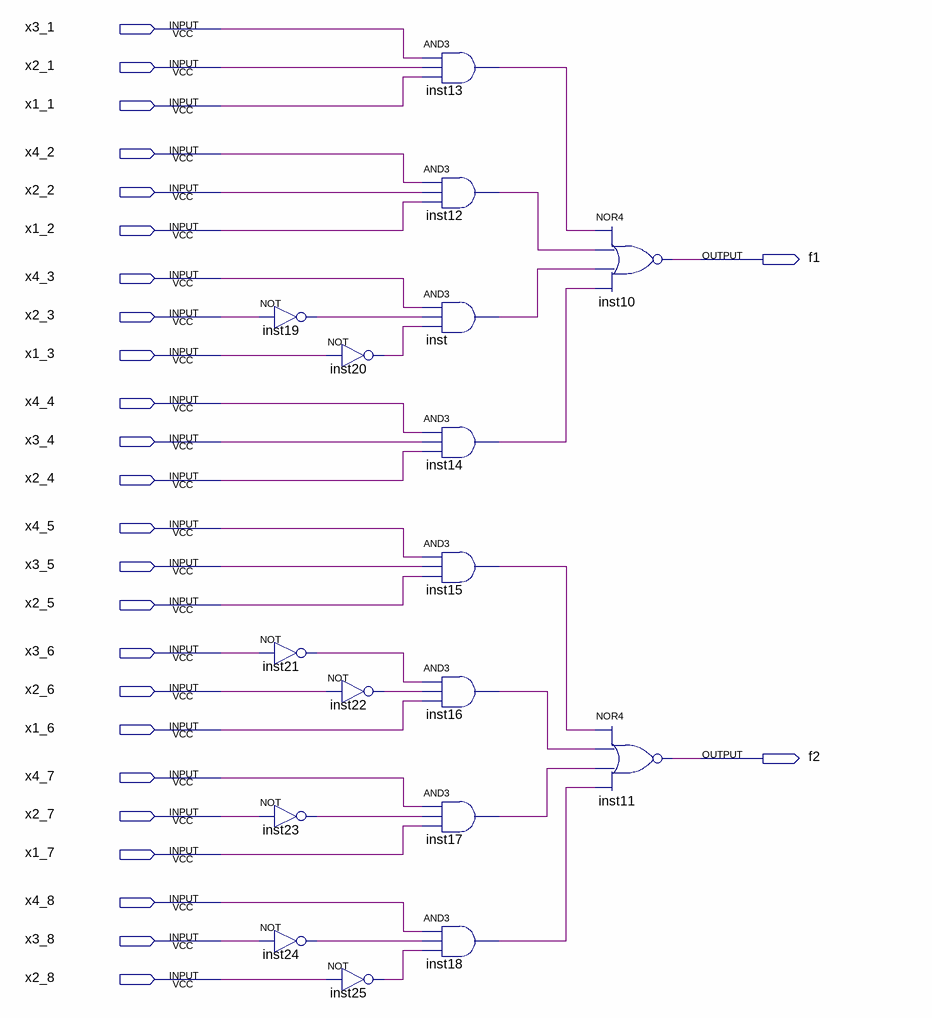
[diagram p0: schematic sheet]
// Quartus schematic DKNF K3.bdf as structural Verilog: 17 symbols, 26 pins
module \DKNF_K3  (
  input  x3_1,
  input  x2_1,
  input  x1_1,
  input  x4_2,
  input  x2_2,
  input  x1_2,
  input  x4_3,
  input  x2_3,
  input  x1_3,
  input  x4_4,
  input  x3_4,
  input  x2_4,
  input  x4_5,
  input  x3_5,
  input  x2_5,
  input  x3_6,
  input  x2_6,
  input  x1_6,
  input  x4_7,
  input  x2_7,
  input  x1_7,
  input  x4_8,
  input  x3_8,
  input  x2_8,
  output f1,
  output f2
);

  wire inst12_out, inst13_out, inst14_out, inst15_out, inst16_out, inst17_out, inst18_out, inst19_out,
       inst20_out, inst21_out, inst22_out, inst23_out, inst24_out, inst25_out, inst_out;

  not inst19 (inst19_out, x2_3);
  not inst21 (inst21_out, x3_6);
  not inst23 (inst23_out, x2_7);
  not inst24 (inst24_out, x3_8);
  not inst20 (inst20_out, x1_3);
  not inst22 (inst22_out, x2_6);
  not inst25 (inst25_out, x2_8);
  and inst13 (inst13_out, x3_1, x2_1, x1_1);
  and inst12 (inst12_out, x4_2, x2_2, x1_2);
  and inst (inst_out, x4_3, inst19_out, inst20_out);
  and inst14 (inst14_out, x4_4, x3_4, x2_4);
  and inst15 (inst15_out, x4_5, x3_5, x2_5);
  and inst16 (inst16_out, inst21_out, inst22_out, x1_6);
  and inst17 (inst17_out, x4_7, inst23_out, x1_7);
  and inst18 (inst18_out, x4_8, inst24_out, inst25_out);
  nor inst10 (f1, inst13_out, inst12_out, inst_out, inst14_out);
  nor inst11 (f2, inst15_out, inst16_out, inst17_out, inst18_out);
endmodule
